# EAGLE schematic sonar_processing (EAGLE 8.3.1)
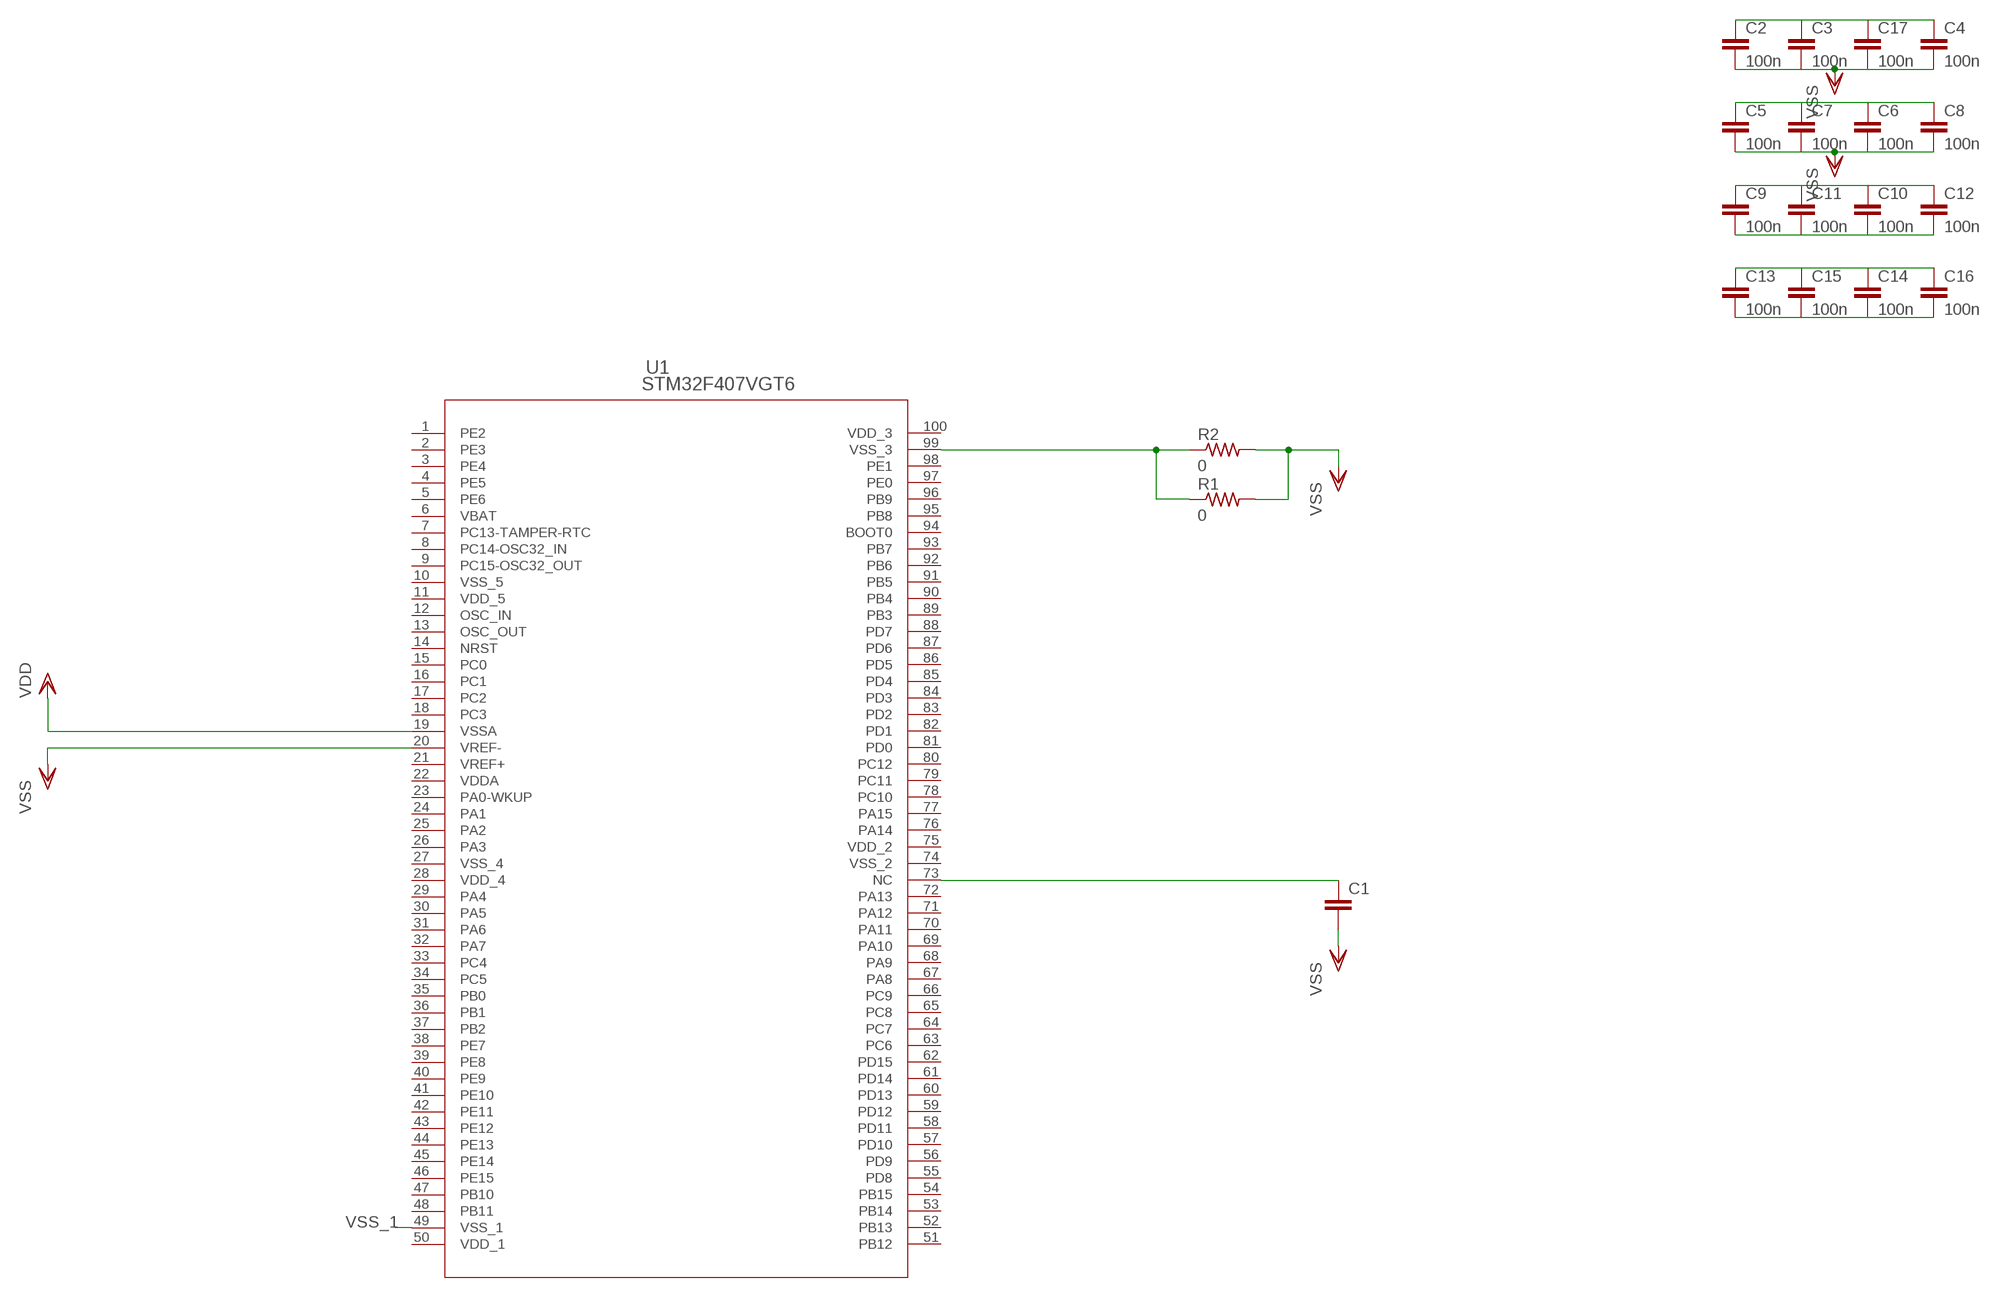
[diagram p0: schematic, sheet 1]

## Parts
C1  C-EUC0805  [C0805]
C2  100n  C-EUC0805  [C0805]
C3  100n  C-EUC0805  [C0805]
C4  100n  C-EUC0805  [C0805]
C5  100n  C-EUC0805  [C0805]
C6  100n  C-EUC0805  [C0805]
C7  100n  C-EUC0805  [C0805]
C8  100n  C-EUC0805  [C0805]
C9  100n  C-EUC0805  [C0805]
C10  100n  C-EUC0805  [C0805]
C11  100n  C-EUC0805  [C0805]
C12  100n  C-EUC0805  [C0805]
C13  100n  C-EUC0805  [C0805]
C14  100n  C-EUC0805  [C0805]
C15  100n  C-EUC0805  [C0805]
C16  100n  C-EUC0805  [C0805]
C17  100n  C-EUC0805  [C0805]
R1  0  R-US_R0805  [R0805]
R2  0  R-US_R0805  [R0805]
U1  STM32F407VGT6  [LQFP-100]

## Nets
N$1: R1.1 R2.1 U1.99(VSS_3)
N$2: C2.1 C4.1
N$3: C1.1 U1.73(NC)
N$5: C5.1 C8.1
N$7: C9.1 C12.1
N$8: C9.2 C12.2
N$9: C13.1 C16.1
N$10: C13.2 C16.2
VDD: U1.19(VSSA)
VSS: C1.2 C2.2 C4.2 C5.2 C8.2 R1.2 R2.2 U1.20(VREF-)
VSS_1: U1.49(VSS_1)
Unconnected: C3.1 C3.2 C6.1 C6.2 C7.1 C7.2 C10.1 C10.2 C11.1 C11.2 C14.1 C14.2 C15.1 C15.2 C17.1 C17.2 U1.1(PE2) U1.2(PE3) U1.3(PE4) U1.4(PE5) U1.5(PE6) U1.7(PC13-TAMPER-RTC) U1.8(PC14-OSC32_IN) U1.9(PC15-OSC32_OUT) U1.12(OSC_IN) U1.13(OSC_OUT) U1.14(NRST) U1.15(PC0) U1.16(PC1) U1.17(PC2) U1.18(PC3) U1.23(PA0-WKUP) U1.24(PA1) U1.25(PA2) U1.26(PA3) U1.29(PA4) U1.30(PA5) U1.31(PA6) U1.32(PA7) U1.33(PC4) U1.34(PC5) U1.35(PB0) U1.36(PB1) U1.37(PB2) U1.38(PE7) U1.39(PE8) U1.40(PE9) U1.41(PE10) U1.42(PE11) U1.43(PE12) U1.44(PE13) U1.45(PE14) U1.46(PE15) U1.47(PB10) U1.48(PB11) U1.51(PB12) U1.52(PB13) U1.53(PB14) U1.54(PB15) U1.55(PD8) U1.56(PD9) U1.57(PD10) U1.58(PD11) U1.59(PD12) U1.60(PD13) U1.61(PD14) U1.62(PD15) U1.63(PC6) U1.64(PC7) U1.65(PC8) U1.66(PC9) U1.67(PA8) U1.68(PA9) U1.69(PA10) U1.70(PA11) U1.71(PA12) U1.72(PA13) U1.76(PA14) U1.77(PA15) U1.78(PC10) U1.79(PC11) U1.80(PC12) U1.81(PD0) U1.82(PD1) U1.83(PD2) U1.84(PD3) U1.85(PD4) U1.86(PD5) U1.87(PD6) U1.88(PD7) U1.89(PB3) U1.90(PB4) U1.91(PB5) U1.92(PB6) U1.93(PB7) U1.94(BOOT0) U1.95(PB8) U1.96(PB9) U1.97(PE0) U1.98(PE1)

## Power pins joined to a net without a drawn wire
VBAT: U1.6(VBAT)
VDD_1: U1.50(VDD_1)
VDD_2: U1.75(VDD_2)
VDD_3: U1.100(VDD_3)
VDD_4: U1.28(VDD_4)
VDD_5: U1.11(VDD_5)
VDDA: U1.22(VDDA)
VREF+: U1.21(VREF+)
VSS_2: U1.74(VSS_2)
VSS_4: U1.27(VSS_4)
VSS_5: U1.10(VSS_5)

## Library data of the parts
C1-C17 = resistor:C-EU: CAPACITOR, European symbol
R1 R2 = rcl:R-US_: RESISTOR, American symbol
U1 = sonar_processing:STM32F407VGT6; MANUFACTURER_PART_NUMBER: STM32F407VGT6; VENDOR: ST Microelectronics